# EAGLE design DOUT (EAGLE 7.1.0)
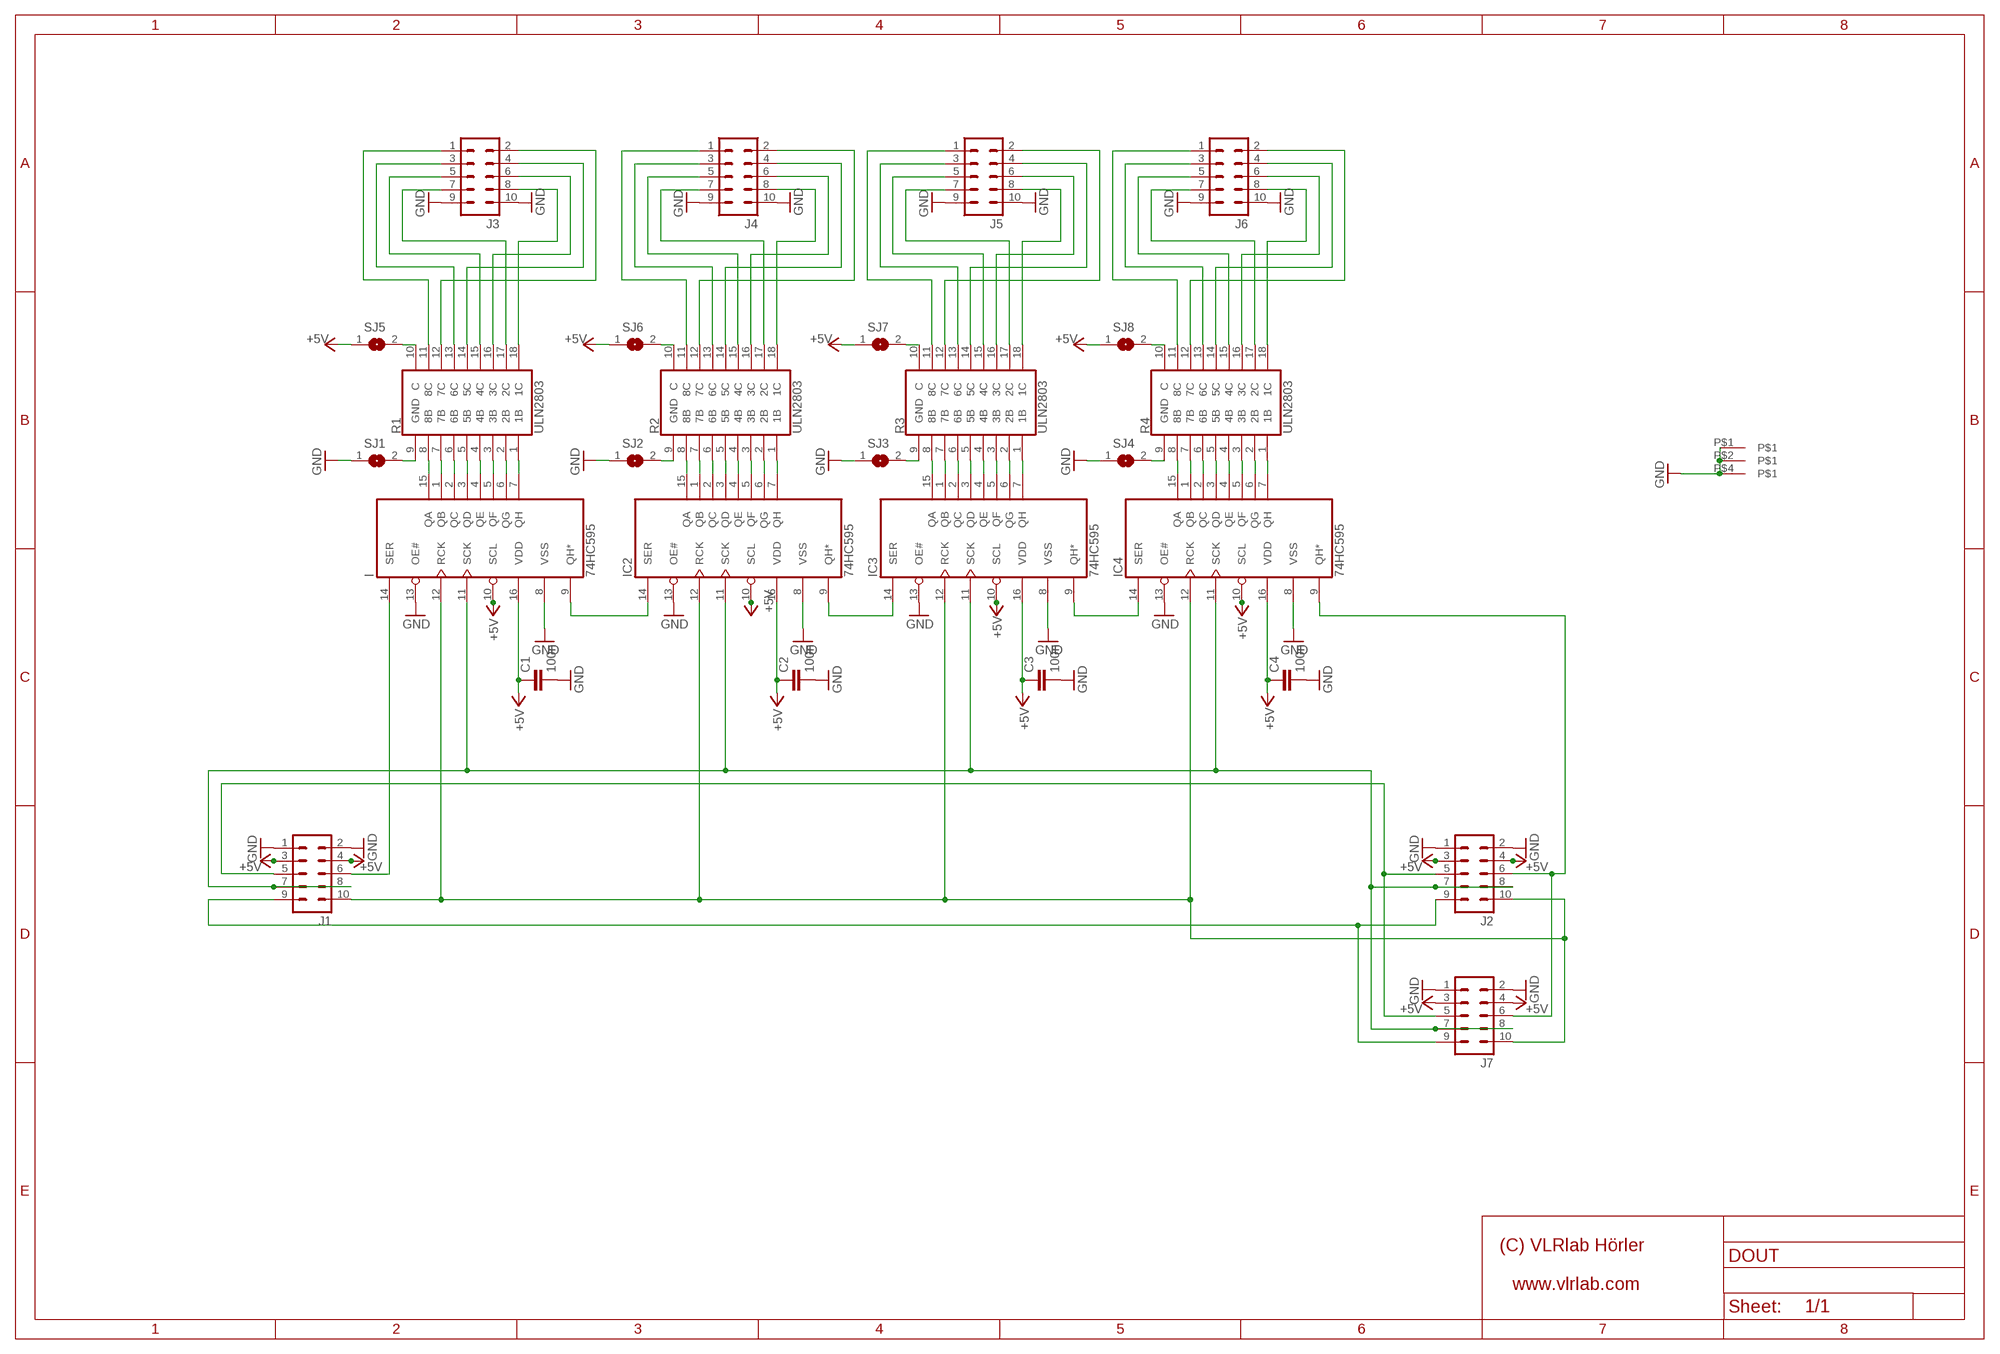
[diagram p0: schematic, sheet 1]

## Parts
C1  100n  C-EU025-025X050  [C025-025X050]
C2  100n  C-EU025-025X050  [C025-025X050]
C3  100n  C-EU025-025X050  [C025-025X050]
C4  100n  C-EU025-025X050  [C025-025X050]
I  74HC595  74HC595DIP16  [DIL16]
IC2  74HC595  74HC595DIP16  [DIL16]
IC3  74HC595  74HC595DIP16  [DIL16]
IC4  74HC595  74HC595DIP16  [DIL16]
J1  ML10  [ML10]
J2  ML10  [ML10]
J3  ML10  [ML10]
J4  ML10  [ML10]
J5  ML10  [ML10]
J6  ML10  [ML10]
J7  ML10  [ML10]
R1  ULN2803  [DIL18]
R2  ULN2803  [DIL18]
R3  ULN2803  [DIL18]
R4  ULN2803  [DIL18]
SJ1  SJ  [SJ]
SJ2  SJ  [SJ]
SJ3  SJ  [SJ]
SJ4  SJ  [SJ]
SJ5  SJ  [SJ]
SJ6  SJ  [SJ]
SJ7  SJ  [SJ]
SJ8  SJ  [SJ]
U$7  MIDIBOX_HALF  [MIDIBOX14X6]

## Nets
+5V: C1.1 C2.1 C3.1 C4.1 I.10(SCL) I.16(VDD) IC2.10(SCL) IC2.16(VDD) IC3.10(SCL) IC3.16(VDD) IC4.10(SCL) IC4.16(VDD) J1.3 J1.4 J2.3 J2.4 J7.3 J7.4 SJ5.1 SJ6.1 SJ7.1 SJ8.1
GND: C1.2 C2.2 C3.2 C4.2 I.8(VSS) I.13(OE#) IC2.8(VSS) IC2.13(OE#) IC3.8(VSS) IC3.13(OE#) IC4.8(VSS) IC4.13(OE#) J1.1 J1.2 J2.1 J2.2 J3.9 J3.10 J4.9 J4.10 J5.9 J5.10 J6.9 J6.10 J7.1 J7.2 SJ1.1 SJ2.1 SJ3.1 SJ4.1 U$7.P$1 U$7.P$2 U$7.P$4
N$1: J3.1 R1.11(8C)
N$2: J3.2 R1.12(7C)
N$3: I.6(QG) R1.2(2B)
N$4: I.5(QF) R1.3(3B)
N$5: I.4(QE) R1.4(4B)
N$6: I.3(QD) R1.5(5B)
N$7: I.2(QC) R1.6(6B)
N$8: I.1(QB) R1.7(7B)
N$9: I.15(QA) R1.8(8B)
N$10: I.7(QH) R1.1(1B)
N$11: IC2.6(QG) R2.2(2B)
N$12: IC2.5(QF) R2.3(3B)
N$13: IC2.4(QE) R2.4(4B)
N$14: IC2.3(QD) R2.5(5B)
N$15: IC2.2(QC) R2.6(6B)
N$16: IC2.1(QB) R2.7(7B)
N$17: IC2.15(QA) R2.8(8B)
N$18: IC2.7(QH) R2.1(1B)
N$19: IC3.6(QG) R3.2(2B)
N$20: IC3.5(QF) R3.3(3B)
N$21: IC3.4(QE) R3.4(4B)
N$22: IC3.3(QD) R3.5(5B)
N$23: IC3.2(QC) R3.6(6B)
N$24: IC3.1(QB) R3.7(7B)
N$25: IC3.15(QA) R3.8(8B)
N$26: IC3.7(QH) R3.1(1B)
N$27: IC4.6(QG) R4.2(2B)
N$28: IC4.5(QF) R4.3(3B)
N$29: IC4.4(QE) R4.4(4B)
N$30: IC4.3(QD) R4.5(5B)
N$31: IC4.2(QC) R4.6(6B)
N$32: IC4.1(QB) R4.7(7B)
N$33: IC4.15(QA) R4.8(8B)
N$34: IC4.7(QH) R4.1(1B)
N$35: J3.3 R1.13(6C)
N$36: J3.4 R1.14(5C)
N$37: J3.5 R1.15(4C)
N$38: J3.6 R1.16(3C)
N$39: J3.7 R1.17(2C)
N$40: J3.8 R1.18(1C)
N$41: J4.1 R2.11(8C)
N$42: J4.2 R2.12(7C)
N$43: J4.3 R2.13(6C)
N$44: J4.4 R2.14(5C)
N$45: J4.5 R2.15(4C)
N$46: J4.6 R2.16(3C)
N$47: J4.7 R2.17(2C)
N$48: J4.8 R2.18(1C)
N$49: J5.1 R3.11(8C)
N$50: J5.2 R3.12(7C)
N$51: J5.3 R3.13(6C)
N$52: J5.4 R3.14(5C)
N$53: J5.5 R3.15(4C)
N$54: J5.6 R3.16(3C)
N$55: J5.7 R3.17(2C)
N$56: J5.8 R3.18(1C)
N$57: J6.1 R4.11(8C)
N$58: J6.2 R4.12(7C)
N$59: J6.3 R4.13(6C)
N$60: J6.4 R4.14(5C)
N$61: J6.5 R4.15(4C)
N$62: J6.6 R4.16(3C)
N$63: J6.7 R4.17(2C)
N$64: J6.8 R4.18(1C)
N$65: J1.5 J2.5 J7.5
N$66: I.14(SER) J1.6
N$67: I.9(QH*) IC2.14(SER)
N$68: IC2.9(QH*) IC3.14(SER)
N$69: IC3.9(QH*) IC4.14(SER)
N$70: IC4.9(QH*) J2.6 J7.6
N$71: I.11(SCK) IC2.11(SCK) IC3.11(SCK) IC4.11(SCK) J1.7 J1.8 J2.7 J2.8 J7.7 J7.8
N$72: I.12(RCK) IC2.12(RCK) IC3.12(RCK) IC4.12(RCK) J1.10 J2.10 J7.10
N$73: J1.9 J2.9 J7.9
N$74: R1.9(GND) SJ1.2
N$75: R1.10(C) SJ5.2
N$76: R2.10(C) SJ6.2
N$77: R2.9(GND) SJ2.2
N$78: R3.9(GND) SJ3.2
N$79: R3.10(C) SJ7.2
N$80: R4.10(C) SJ8.2
N$81: R4.9(GND) SJ4.2

## Library data of the parts
C1-C4 = rcl:C-EU: CAPACITOR, European symbol
I IC2-IC4 = 595-541-165-uln2803:74HC595
J1-J7 = con-ml:ML10: HARTING; OC_FARNELL: unknown; OC_NEWARK: unknown
R1-R4 = 595-541-165-uln2803:ULN2803
SJ1-SJ8 = Jumper:SJ: SMD solder JUMPER
U$7 = Frames_VLR:MIDIBOX_HALF

## Board
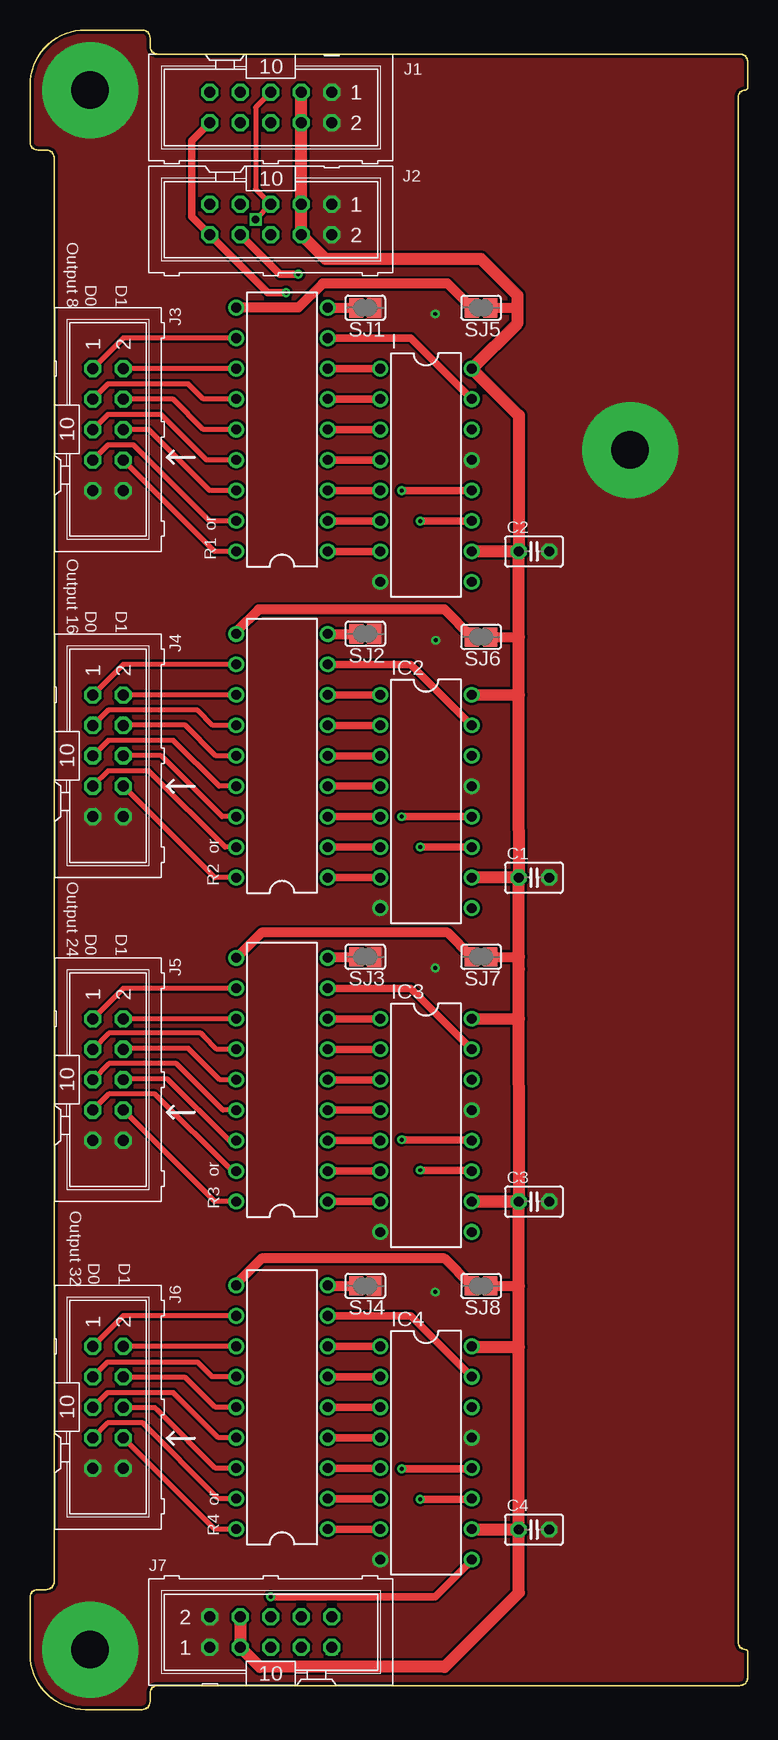
[diagram p1: board, top side]
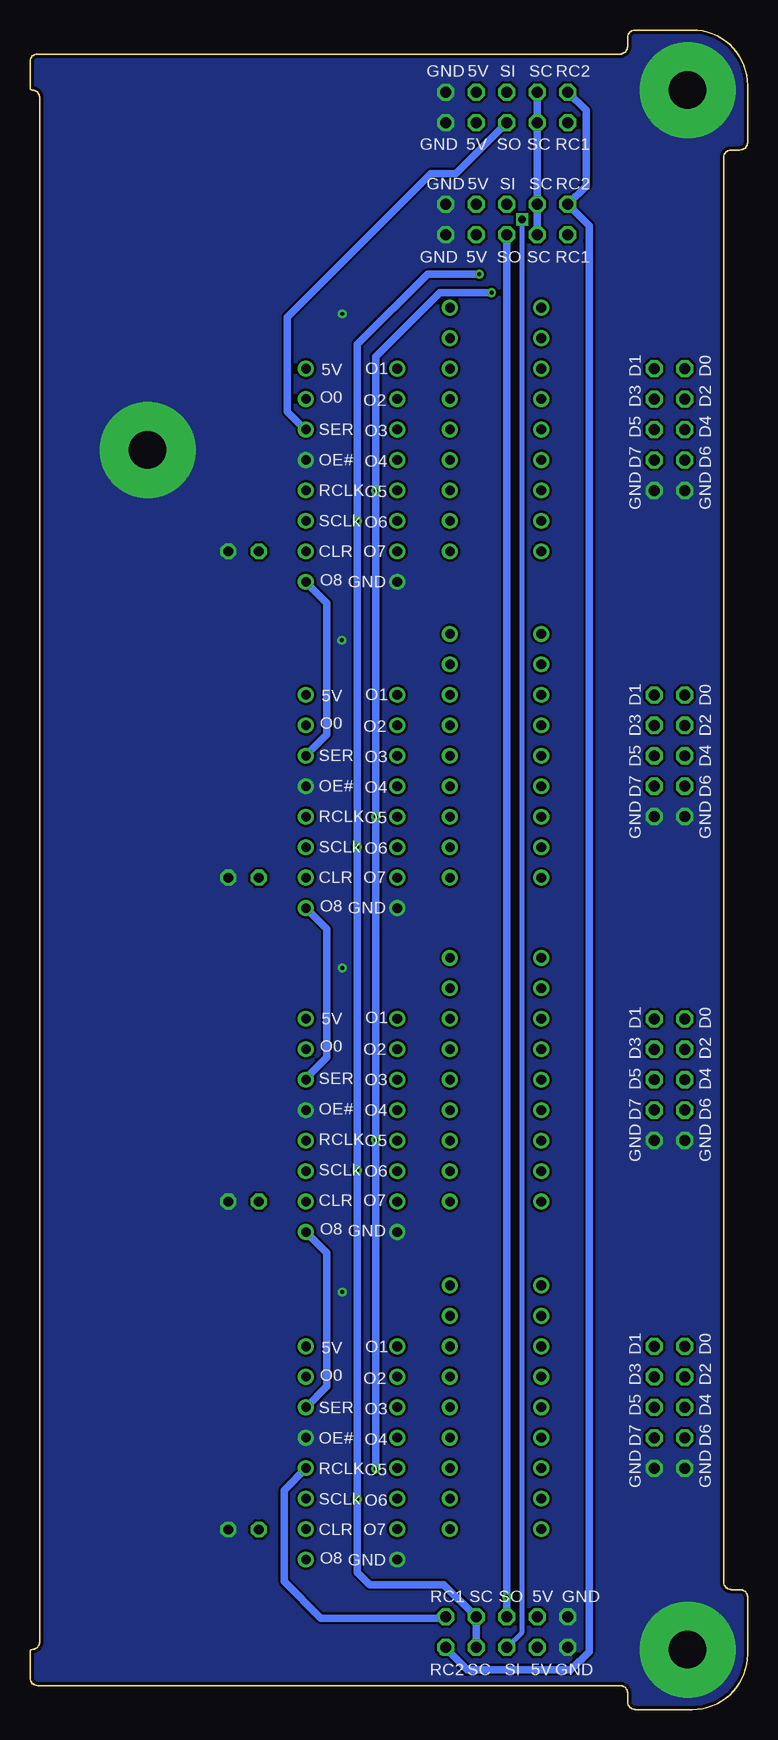
[diagram p2: board, bottom side, seen from below]

Size 59.8 x 140 mm. Coordinates in mm from the lower left corner, seen from the top.
Copper layers (1*16): Top 0.035mm / dielectric 1.5mm / Bottom 0.035mm
Design rules "default *": minimum track width 10mil, minimum drill 24mil, track to track 8mil, track to pad 8mil, pad to pad 8mil, via to via 8mil, smd to smd 8mil, copper to edge 10mil, drill to drill 8mil, minimum pad ring 10mil, minimum via ring 8mil, stop-mask expansion 4mil, vias tented up to drill 0mil, thermal gap 0mil

### Footprints (pad centres in the part's own frame; a part is rotated, then mirrored left to right if it is on the bottom)
C025-025X050 = drill 0.813 octagon: 1 -1.27,0; 2 1.27,0
DIL16 = drill 0.813: 1 -8.89,-3.81; 2 -6.35,-3.81; 3 -3.81,-3.81; 4 -1.27,-3.81; 5 1.27,-3.81; 6 3.81,-3.81; 7 6.35,-3.81; 8 8.89,-3.81; 9 8.89,3.81; 10 6.35,3.81; 11 3.81,3.81; 12 1.27,3.81; 13 -1.27,3.81; 14 -3.81,3.81; 15 -6.35,3.81; 16 -8.89,3.81
ML10 = drill 0.914 octagon: 1 -5.08,-1.27; 2 -5.08,1.27; 3 -2.54,-1.27; 4 -2.54,1.27; 5 0,-1.27; 6 0,1.27; 7 2.54,-1.27; 8 2.54,1.27; 9 5.08,-1.27; 10 5.08,1.27
DIL18 = drill 0.813: 1 -10.16,-3.81; 2 -7.62,-3.81; 3 -5.08,-3.81; 4 -2.54,-3.81; 5 0,-3.81; 6 2.54,-3.81; 7 5.08,-3.81; 8 7.62,-3.81; 9 10.16,-3.81; 10 10.16,3.81; 11 7.62,3.81; 12 5.08,3.81; 13 2.54,3.81; 14 0,3.81; 15 -2.54,3.81; 16 -5.08,3.81; 17 -7.62,3.81; 18 -10.16,3.81
SJ = smd 1.168 x 1.6: 1 -0.762,0; 2 0.762,0
MIDIBOX14X6 = drill 3.1 pad 8: P$1 5,135; P$2 50,105; P$4 5,5

### Placement (x,y rotation side)
C1  42,69.34 0 top
C2  42,96.54 0 top
C3  42,42.34 0 top
C4  42,15 0 top
I  33,102.89 270 top
IC2  33,75.69 270 top
IC3  33,48.69 270 top
IC4  33,21.39 270 top
J1  20.07,133.55 180 top
J2  20.07,124.2 180 top
J3  6.5,106.7 270 top
J4  6.5,79.5 270 top
J5  6.5,52.5 270 top
J6  6.5,25.2 270 top
J7  20.07,6.45 0 top
R1  21,106.7 90 top
R2  21,79.5 90 top
R3  21,52.5 90 top
R4  21,25.2 90 top
SJ1  27.94,116.84 180 top
SJ2  27.94,89.66 180 top
SJ3  27.94,62.74 180 top
SJ4  27.94,35.31 180 top
SJ5  37.59,116.84 180 top
SJ6  37.59,89.41 180 top
SJ7  37.59,62.74 180 top
SJ8  37.59,35.31 180 top
U$2  [DOUT]  40.64,133.35 0 top
U$3  [DOUT]  52.07,133.35 0 bottom
U$4  [VLRLAB]  41.91,3.81 0 top
U$5  [VLRLAB]  53.34,3.81 0 bottom
U$7  0,0 0 top

### Tracks (layer width: path | path; a pad name or v marks a point on that pad's centre or on a via)
+5V  (1 unrouted)
  Top 0.813: SJ5.1 40.64,116.84 | SJ6.1 40.73,89.41 | SJ7.1 40.73,62.74 | SJ8.1 40.73,35.31
  Top 1.016: C2.1 I.10 | C1.1 IC2.10 | IC4.10 36.85,15 C4.1 40.73,9.74 34.54,3.56 19.15,3.56 J7.3 J7.4 | C4.1 40.73,30.23 | 40.73,30.23 40.73,35.31 C3.1 IC3.10 40.76,42.35 40.73,61.72 | IC3.16 40.73,57.59 40.73,61.72 | 40.73,61.72 40.73,62.74 C1.1 | IC2.16 40.73,84.59 | 40.73,84.59 40.73,89.41 | 40.73,89.41 C2.1 | J2.4 24.64,120.9 37.59,120.9 40.64,117.86 40.64,116.84 40.64,115.57 I.16 40.73,107.86 C2.1 | J2.4 | J2.4 J2.3 J1.4 J1.3 | 40.73,84.59 40.73,73.26 C1.1 | 40.73,84.59 40.73,89.41 | 40.73,89.41 C2.1 | IC4.16 36.86,30.23 40.73,30.23
GND  (via drill 0.33)
  other vias: 33.78,34.8 33.78,61.82 33.81,89.13 33.78,116.33
  pour Bottom: -23.8,149.7 77.8,149.7 77.8,-10.1 -23.8,-10.1 -23.8,149.4
  pour Top: -23.8,149.7 77.8,149.7 77.8,-10.1 -23.8,-10.1 -23.8,149.4
N$1
  Top 0.406: R1.11 7.77,114.32 J3.1
N$2
  Top 0.406: R1.12 J3.2
N$3
  Top 0.61: I.6 R1.2
N$4
  Top 0.61: I.5 R1.3
N$5
  Top 0.61: I.4 R1.4
N$6
  Top 0.61: I.3 R1.5
N$7
  Top 0.61: I.2 R1.6
N$8
  Top 0.61: I.1 R1.7
N$9
  Top 0.61: I.15 31.73,114.32 R1.8
N$10
  Top 0.61: I.7 R1.1
N$11
  Top 0.61: IC2.6 R2.2
N$12
  Top 0.61: IC2.5 R2.3
N$13
  Top 0.61: IC2.4 R2.4
N$14
  Top 0.61: IC2.3 R2.5
N$15
  Top 0.61: IC2.2 R2.6
N$16
  Top 0.61: IC2.1 R2.7
N$17
  Top 0.61: IC2.15 31.73,87.12 R2.8
N$18
  Top 0.61: IC2.7 R2.1
N$19
  Top 0.61: IC3.6 R3.2
N$20
  Top 0.61: IC3.5 R3.3
N$21
  Top 0.61: IC3.4 R3.4
N$22
  Top 0.61: IC3.3 R3.5
N$23
  Top 0.61: IC3.2 R3.6
N$24
  Top 0.61: IC3.1 R3.7
N$25
  Top 0.61: IC3.15 31.73,60.12 R3.8
N$26
  Top 0.61: IC3.7 R3.1
N$27
  Top 0.61: IC4.6 R4.2
N$28
  Top 0.61: IC4.5 R4.3
N$29
  Top 0.61: IC4.4 R4.4
N$30
  Top 0.61: IC4.3 R4.5
N$31
  Top 0.61: IC4.2 R4.6
N$32
  Top 0.61: IC4.1 R4.7
N$33
  Top 0.61: IC4.15 31.73,32.82 R4.8
N$34
  Top 0.61: IC4.7 R4.1
N$35
  Top 0.406: R1.13 14.46,109.24 13.21,110.49 6.48,110.49 J3.3
N$36  (via drill 0.6)
  Top 0.406: R1.14 14.46,106.7 11.94,109.22 v7.79,109.22
  Bottom 0.406: v7.79,109.22 J3.4
N$37
  Top 0.406: R1.15 14.71,104.16 10.92,107.95 6.48,107.95 J3.5
N$38  (via drill 0.6)
  Top 0.406: R1.16 14.97,101.62 9.91,106.68 v7.79,106.68
  Bottom 0.406: v7.79,106.68 J3.6
N$39
  Top 0.406: R1.17 14.97,99.08 8.64,105.41 6.48,105.41 J3.7
N$40
  Top 0.406: R1.18 15.39,96.54 J3.8
N$41
  Top 0.406: R2.11 7.77,87.12 J4.1
N$42
  Top 0.406: R2.12 J4.2
N$43
  Top 0.406: R2.13 15.24,82.04 13.97,83.31 6.5,83.31 J4.3
N$44
  Top 0.406: R2.14 15.5,79.5 12.95,82.04 J4.4
N$45
  Top 0.406: R2.15 15.75,76.96 11.94,80.77 6.5,80.77 J4.5
N$46
  Top 0.406: R2.16 16,74.42 10.92,79.5 J4.6
N$47
  Top 0.406: R2.17 16.26,71.88 10.16,77.98 9.91,78.23 6.5,78.23 J4.7
N$48
  Top 0.406: R2.18 15.39,69.34 J4.8
N$49
  Top 0.406: R3.11 7.77,60.12 J5.1
N$50
  Top 0.406: R3.12 J5.2
N$51
  Top 0.406: R3.13 15.57,55.04 14.48,56.13 14.22,56.39 6.58,56.39 J5.3
N$52
  Top 0.406: R3.14 15.83,52.5 13.21,55.12 7.85,55.12 J5.4
N$53
  Top 0.406: R3.15 16.08,49.96 12.19,53.85 6.58,53.85 J5.5
N$54
  Top 0.406: R3.16 16.59,47.42 11.43,52.58 7.85,52.58 J5.6
N$55
  Top 0.406: R3.17 16.84,44.88 10.41,51.31 6.58,51.31 J5.7
N$56
  Top 0.406: R3.18 15.39,42.34 J5.8
N$57
  Top 0.406: R4.11 7.77,32.82 J6.1
N$58
  Top 0.406: R4.12 J6.2
N$59
  Top 0.406: R4.13 15.19,27.74 13.97,28.96 6.45,28.96 J6.3
N$60
  Top 0.406: R4.14 15.44,25.2 12.95,27.69 7.82,27.69 J6.4
N$61
  Top 0.406: R4.15 15.69,22.66 11.94,26.42 6.45,26.42 J6.5
N$62
  Top 0.406: R4.16 15.44,20.12 10.92,24.64 10.67,24.89 10.41,25.15 7.82,25.15 J6.6
N$63
  Top 0.406: R4.17 15.69,17.58 9.4,23.88 6.45,23.88 J6.7
N$64
  Top 0.406: R4.18 15.39,15.04 J6.8
N$65  (via drill 0.6)
  Top 0.406: J1.5 18.8,133.55 18.8,126.75 18.8,126.74 J2.5 v18.81,124.21 v18.8,124.21
  Bottom 0.406: J7.5 18.8,6.45 v18.8,124.21
N$66
  Bottom 0.61: J1.6 24.33,128.02 26.42,128.02 38.35,116.08 38.35,108.2 36.85,106.7 I.14
N$67
  Bottom 0.61: I.9 35.05,92.24 35.05,81.28 36.81,79.52 IC2.14
N$68
  Bottom 0.61: IC2.9 35.05,65.04 35.05,54.36 36.81,52.6 IC3.14
N$69
  Bottom 0.61: IC3.9 35.05,38.04 35.05,26.92 36.78,25.2 IC4.14
N$70  (via drill 0.33, 0.6)
  Top 0.61: J2.6 | v20.07,9.4 24.89,9.4 33.78,9.4 36.81,12.43 IC4.9
  Bottom 0.61: J2.6 v20.07,9.4 J7.6
  other vias: 20.07,122.93
N$71  (via drill 0.33)
  Top 0.61: J2.8 20.83,119.63 v22.35,119.63 | I.11 36.79,99.06 v32.51,99.06 | IC2.11 v32.51,71.88 | IC4.11 36.76,17.53 v32.51,17.53 | IC3.11 36.73,44.96 v32.51,44.96
  Bottom 0.61: J2.8 J2.7 J1.8 J1.7 | v22.35,119.63 26.67,119.63 32.51,113.79 v32.51,99.06 v32.51,71.88 v32.51,44.96 v32.51,17.53 32.51,11.43 31.5,10.41 25.3,10.41 J7.8 J7.7
N$72  (via drill 0.33)
  Top 0.61: J1.10 13.46,130.75 13.46,124.46 J2.10 19.81,118.11 v21.34,118.11 | I.12 36.79,101.6 v30.99,101.6 | IC2.12 v30.99,74.42 | IC4.12 36.76,20.07 v30.99,20.07 | IC3.12 36.73,47.5 v30.99,47.5
  Bottom 0.61: v21.34,118.11 25.65,118.11 30.99,112.78 v30.99,101.6 v30.99,74.42 v30.99,47.5 v30.99,20.07 | J7.10 25.25,7.62 35.56,7.62 38.61,10.67 38.61,18.29 36.81,20.09 IC4.12
N$73  (via drill 0.6)
  Top 0.61: v25.15,5.08 J7.9
  Bottom 0.61: J1.9 13.46,133.29 13.46,127 J2.9 | J2.9 13.21,123.7 13.21,122.42 13.21,4.83 14.73,3.3 23.37,3.3 v25.15,5.08 | J2.9
N$74
  Top 0.813: R1.9 24.83,116.84 SJ1.2
N$75
  Top 0.813: SJ5.2 34.8,118.87 24.38,118.87 22.37,116.86 R1.10
N$76
  Top 0.813: SJ6.2 34.54,91.69 19.05,91.69 17.19,89.83 R2.10
N$77
  Top 0.813: R2.9 SJ2.2
N$78
  Top 0.813: R3.9 24.89,62.74 SJ3.2
N$79
  Top 0.813: SJ7.2 34.8,64.77 19.3,64.77 17.53,62.99 R3.10
N$80
  Top 0.813: SJ8.2 34.54,37.59 19.3,37.59 17.19,35.48 R4.10
N$81
  Top 0.813: R4.9 24.86,35.31 SJ4.2

### Text on the board
tNames: D0 | D1 | Output 8 | or | D0 | D1 | Output 16 | or | D0 | D1 | Output 24 | or | D0 | D1 | Output 32 | or
bNames: RC2 | SC | SI | 5V | GND | RC1 | SC | SO | 5V | GND | RC2 | SC | SI | 5V | GND | RC1 | SC | SO | 5V | GND | D0 | D1 | O1 | 5V | O2 | D2 | D3 | O0 | D4 | D5 | O3 | SER | O4 | D6 | D7 | OE# | GND | GND | O5 | RCLK | O6 | SCLk | O7 | CLR | GND | O8 | D0 | D1 | O1 | 5V | D2 | D3 | O2 | O0 | D4 | D5 | O3 | SER | D6 | D7 | O4 | OE# | O5 | GND | GND | RCLK | O6 | SCLk | O7 | CLR | GND | O8 | D0 | D1 | O1 | 5V | O2 | D2 | D3 | O0 | D4 | D5 | O3 | SER | D6 | D7 | O4 | OE# | O5 | GND | GND | RCLK | O6 | SCLk | O7 | CLR | GND | O8 | O1 | D0 | D1 | 5V | D2 | D3 | O2 | O0 | O3 | D4 | D5 | SER | D6 | D7 | O4 | OE# | O5 | GND | GND | RCLK | O6 | SCLk | O7 | CLR | GND | O8 | GND | 5V | SO | SC | RC1 | GND | 5V | SI | SC | RC2